# EAGLE design jkw_hdmi_micro_drill (EAGLE 6.5.0)
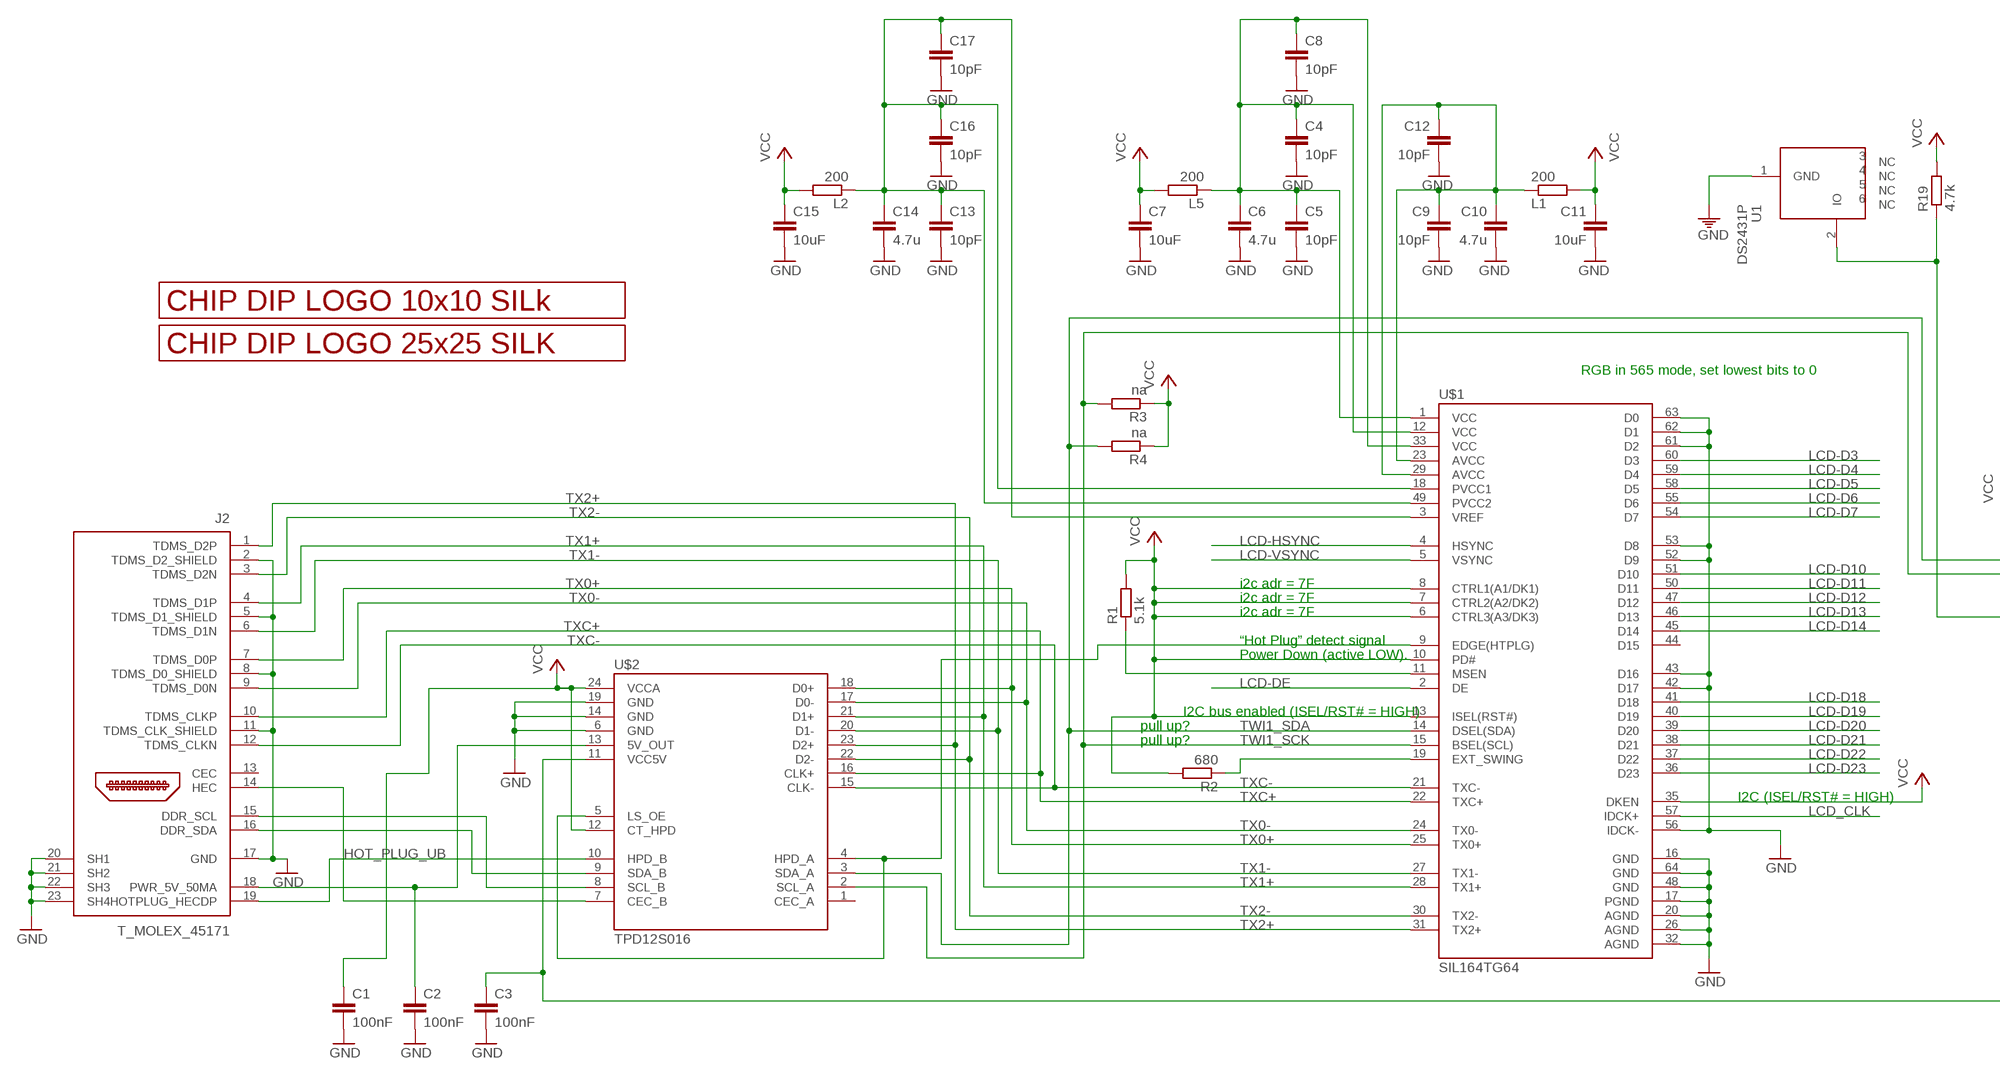
[diagram p0: schematic, sheet 1, part 1 of 2]
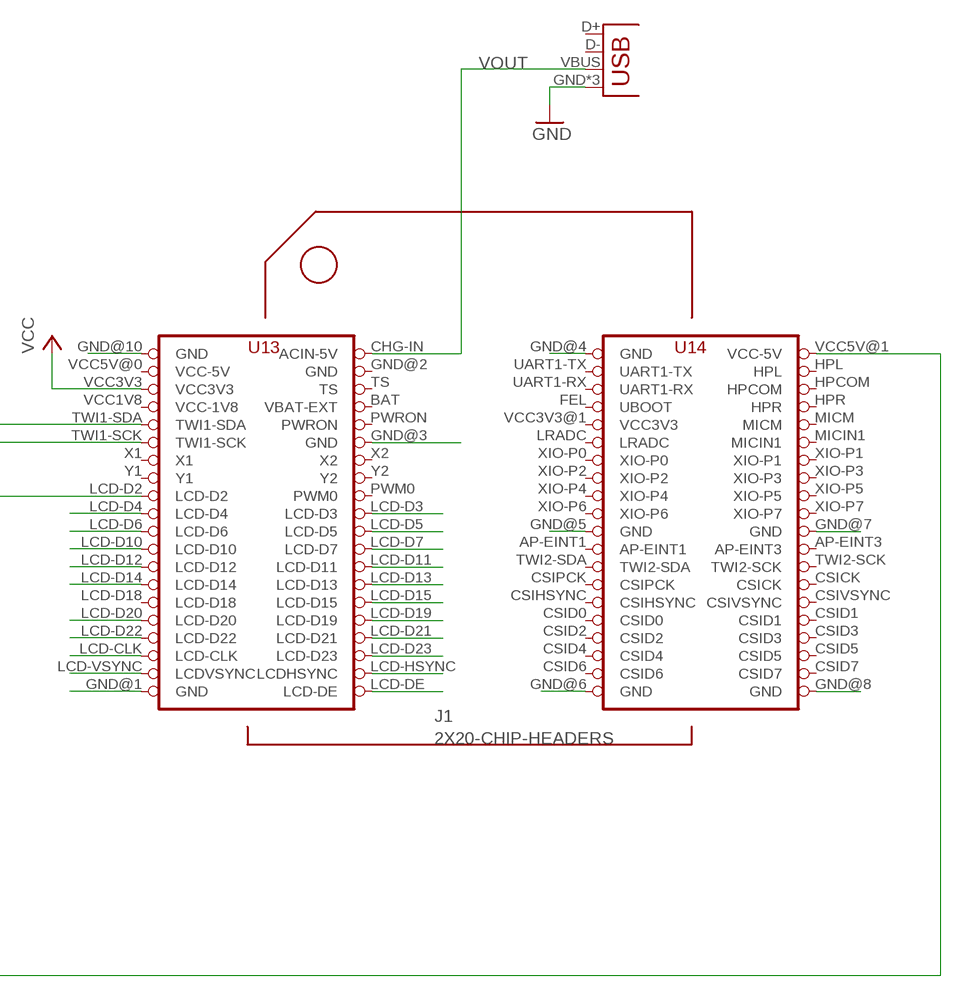
[diagram p1: schematic, sheet 1, part 2 of 2]

## Parts
C1  100nF  C-EUC0805  [C0805]
C2  100nF  C-EUC0805  [C0805]
C3  100nF  C-EUC0805  [C0805]
C4  10pF  C-EUC0805  [C0805]
C5  10pF  C-EUC0805  [C0805]
C6  4.7u  C-EUC0805  [C0805]
C7  10uF  C-EUC0805  [C0805]
C8  10pF  C-EUC0805  [C0805]
C9  10pF  C-EUC0805  [C0805]
C10  4.7u  C-EUC0805  [C0805]
C11  10uF  C-EUC0805  [C0805]
C12  10pF  C-EUC0805  [C0805]
C13  10pF  C-EUC0805  [C0805]
C14  4.7u  C-EUC0805  [C0805]
C15  10uF  C-EUC0805  [C0805]
C16  10pF  C-EUC0805  [C0805]
C17  10pF  C-EUC0805  [C0805]
J1  2X20-CHIP-HEADERS  [2X20CHIP_SM]
J2  T_MOLEX_45171  [T_MOLEX_45171]
L1  200  R-EU_R0805  [R0805]
L2  200  R-EU_R0805  [R0805]
L5  200  R-EU_R0805  [R0805]
POWER_USB  USBUSB-MICROB-SMT-DIP  [USB-MICROB-SMT-DIP]
R1  5.1k  R-EU_M0805  [M0805]
R2  680  R-EU_M0805  [M0805]
R3  na  R-EU_M0805  [M0805]
R4  na  R-EU_M0805  [M0805]
R19  4.7k  R-EU_R0805  [R0805]
U1  DS2431P  [TSOC6]
U$1  SIL164TG64  [TQFP64]
U$2  TPD12S016  [DIL24]
U$3  LOGO_10X10_SILK  [LOGO_10X10_SILK]
U$4  LOGO_25X25_SILK  [LOGO_25X25_SILK]

## Nets
ASD: R1.1 U$1.11(MSEN)
GND: C1.2 C2.2 C3.2 C4.2 C5.2 C6.2 C7.2 C8.2 C9.2 C10.2 C11.2 C12.2 C13.2 C14.2 C15.2 C16.2 C17.2 J1.GND@1(GND) J1.GND@3(GND) J1.GND@4(GND) J1.GND@5(GND) J1.GND@6(GND) J1.GND@7(GND) J1.GND@8(GND) J1.GND@10(GND) J2.2(TDMS_D2_SHIELD) J2.5(TDMS_D1_SHIELD) J2.8(TDMS_D0_SHIELD) J2.11(TDMS_CLK_SHIELD) J2.17(GND) J2.20(SH1) J2.21(SH2) J2.22(SH3) J2.23(SH4) POWER_USB.GND POWER_USB.MT1(GND) POWER_USB.MT2(GND) U1.1(GND) U$1.16(GND) U$1.17(PGND) U$1.20(AGND) U$1.26(AGND) U$1.32(AGND) U$1.42(D17) U$1.43(D16) U$1.48(GND) U$1.52(D9) U$1.53(D8) U$1.56(IDCK-) U$1.61(D2) U$1.62(D1) U$1.63(D0) U$1.64(GND) U$2.6(GND) U$2.14(GND) U$2.19(GND)
HOT_PLUG_UB: J2.19(HOTPLUG_HECDP) U$2.10(HPD_B)
HOTPLUG_DET: U$1.9(EDGE(HTPLG)) U$2.4(HPD_A) U$2.5(LS_OE)
LCD-D3: J1.LCD-D3 U$1.60(D3)
LCD-D4: J1.LCD-D4 U$1.59(D4)
LCD-D5: J1.LCD-D5 U$1.58(D5)
LCD-D6: J1.LCD-D6 U$1.55(D6)
LCD-D7: J1.LCD-D7 U$1.54(D7)
LCD-D10: J1.LCD-D10 U$1.51(D10)
LCD-D11: J1.LCD-D11 U$1.50(D11)
LCD-D12: J1.LCD-D12 U$1.47(D12)
LCD-D13: J1.LCD-D13 U$1.46(D13)
LCD-D14: J1.LCD-D14 U$1.45(D14)
LCD-D15: J1.LCD-D15
LCD-D18: U$1.41(D18)
LCD-D19: J1.LCD-D19 U$1.40(D19)
LCD-D20: J1.LCD-D20 U$1.39(D20)
LCD-D21: J1.LCD-D21 U$1.38(D21)
LCD-D22: J1.LCD-D22 U$1.37(D22)
LCD-D23: J1.LCD-D23 U$1.36(D23)
LCD-DE: J1.LCD-DE U$1.2(DE)
LCD-HSYNC: J1.LCD-HSYNC(LCDHSYNC) U$1.4(HSYNC)
LCD-VSYNC: J1.LCD-VSYNC(LCDVSYNC) U$1.5(VSYNC)
LCD_CLK: J1.LCD-CLK U$1.57(IDCK+)
N$2: R2.1 U$1.19(EXT_SWING)
N$3: C2.1 J2.18(PWR_5V_50MA) U$2.13(5V_OUT)
N$4: C4.1 C5.1 C6.1 C8.1 L5.1 U$1.1(VCC) U$1.12(VCC) U$1.33(VCC)
N$5: J1.LCD-D2 R19.1 U1.2(IO)
N$6: J2.15(DDR_SCL) U$2.8(SCL_B)
N$7: J2.16(DDR_SDA) U$2.9(SDA_B)
N$8: C9.1 C10.1 C12.1 L1.1 U$1.23(AVCC) U$1.29(AVCC)
N$9: J2.14(HEC) U$2.7(CEC_B)
N$10: C13.1 C14.1 C16.1 C17.1 L2.1 U$1.3(VREF) U$1.18(PVCC1) U$1.49(PVCC2)
TWI1_SCK: J1.TWI1-SCK R3.2 U$1.15(BSEL(SCL)) U$2.2(SCL_A)
TWI1_SDA: J1.TWI1-SDA R4.2 U$1.14(DSEL(SDA)) U$2.3(SDA_A)
TX0+: J2.7(TDMS_D0P) U$1.25(TX0+) U$2.18(D0+)
TX0-: J2.9(TDMS_D0N) U$1.24(TX0-) U$2.17(D0-)
TX1+: J2.4(TDMS_D1P) U$1.28(TX1+) U$2.21(D1+)
TX1-: J2.6(TDMS_D1N) U$1.27(TX1-) U$2.20(D1-)
TX2+: J2.1(TDMS_D2P) U$1.31(TX2+) U$2.23(D2+)
TX2-: J2.3(TDMS_D2N) U$1.30(TX2-) U$2.22(D2-)
TXC+: J2.10(TDMS_CLKP) U$1.22(TXC+) U$2.16(CLK+)
TXC-: J2.12(TDMS_CLKN) U$1.21(TXC-) U$2.15(CLK-)
VCC: C1.1 C7.1 C11.1 C15.1 J1.VCC3V3 L1.2 L2.2 L5.2 R1.2 R2.2 R3.1 R4.1 R19.2 U$1.6(CTRL3(A3/DK3)) U$1.7(CTRL2(A2/DK2)) U$1.8(CTRL1(A1/DK1)) U$1.10(PD#) U$1.13(ISEL(RST#)) U$1.35(DKEN) U$2.12(CT_HPD) U$2.24(VCCA)
VCC_5V_DCC: C3.1 J1.VCC5V@1(VCC-5V) U$2.11(VCC5V)
VOUT: J1.CHG-IN(ACIN-5V) POWER_USB.VBUS
Unconnected: J1.AP-EINT1 J1.AP-EINT3 J1.BAT(VBAT-EXT) J1.CSICK J1.CSID0 J1.CSID1 J1.CSID2 J1.CSID3 J1.CSID4 J1.CSID5 J1.CSID6 J1.CSID7 J1.CSIHSYNC J1.CSIPCK J1.CSIVSYNC J1.FEL(UBOOT) J1.HPCOM J1.HPL J1.HPR J1.LCD-D18 J1.LRADC J1.MICIN1 J1.MICM J1.PWM0 J1.PWRON J1.TS J1.TWI2-SCK J1.TWI2-SDA J1.UART1-RX J1.UART1-TX J1.X1 J1.X2 J1.XIO-P0 J1.XIO-P1 J1.XIO-P2 J1.XIO-P3 J1.XIO-P4 J1.XIO-P5 J1.XIO-P6 J1.XIO-P7 J1.Y1 J1.Y2 J2.13(CEC) POWER_USB.D+ POWER_USB.D- U1.3(NC) U1.4(NC) U1.5(NC) U1.6(NC) U$2.1(CEC_A)

## Notes on the sheet
- RGB in 565 mode, set lowest bits to 0
- i2c adr = 7F
- i2c adr = 7F
- i2c adr = 7F
- “Hot Plug” detect signal
- Power Down (active LOW).
- I2C bus enabled (ISEL/RST# = HIGH)
- pull up?
- pull up?
- I2C (ISEL/RST# = HIGH)

## Power pins joined to a net without a drawn wire
D15: U$1.44(D15)
GND: J1.GND@2(GND)
VCC3V3: J1.VCC3V3@1(VCC3V3)
VCC-1V8: J1.VCC1V8(VCC-1V8)
VCC-5V: J1.VCC5V@0(VCC-5V)

## Library data of the parts
C1-C17 = rcl:C-EU: CAPACITOR, European symbol
J1 = VGA-DIP:2X20-CHIP-HEADERS: Through hole layout with chip reference
J2 = CHIP_HDMI:T_MOLEX_45171
L1 L2 L5 R1-R4 R19 = rcl:R-EU_: RESISTOR, European symbol
POWER_USB = Spark:USB
U1 = VGA-DIP:DS2431: 1024-Bit EEPROM This chip provides a 4x256 Bit EEPROM, which can be programmed@5V. Write protection and OTP emulation are available, too. Author: Jan Kandziora <jjj@gmx.de>; DESCRIPTION: IC, 1024-Bit, 1-Wire EEPROM, TSOC6; FOOTPRINT: TSOC6; LINK: http://www.digikey.com/product-detail/en/DS2431P%2BT%26R/DS2431P%2BT%26RCT-ND/3647900; MFG: DIGIKEY; MFG_PN: DS2431P+T&RCT-ND; PART_TYPE: IC; PRICE: 0.98; VENDOR: MAXIM; VENDOR_PART_NUMBER: DS2431P+T&R
U$1 = SII164CTG64:SIL164TG64
U$2 = SII164CTG64:TPD12S016
U$3 = logo:LOGO_10X10_SILK
U$4 = logo:LOGO_25X25_SILK

## Board
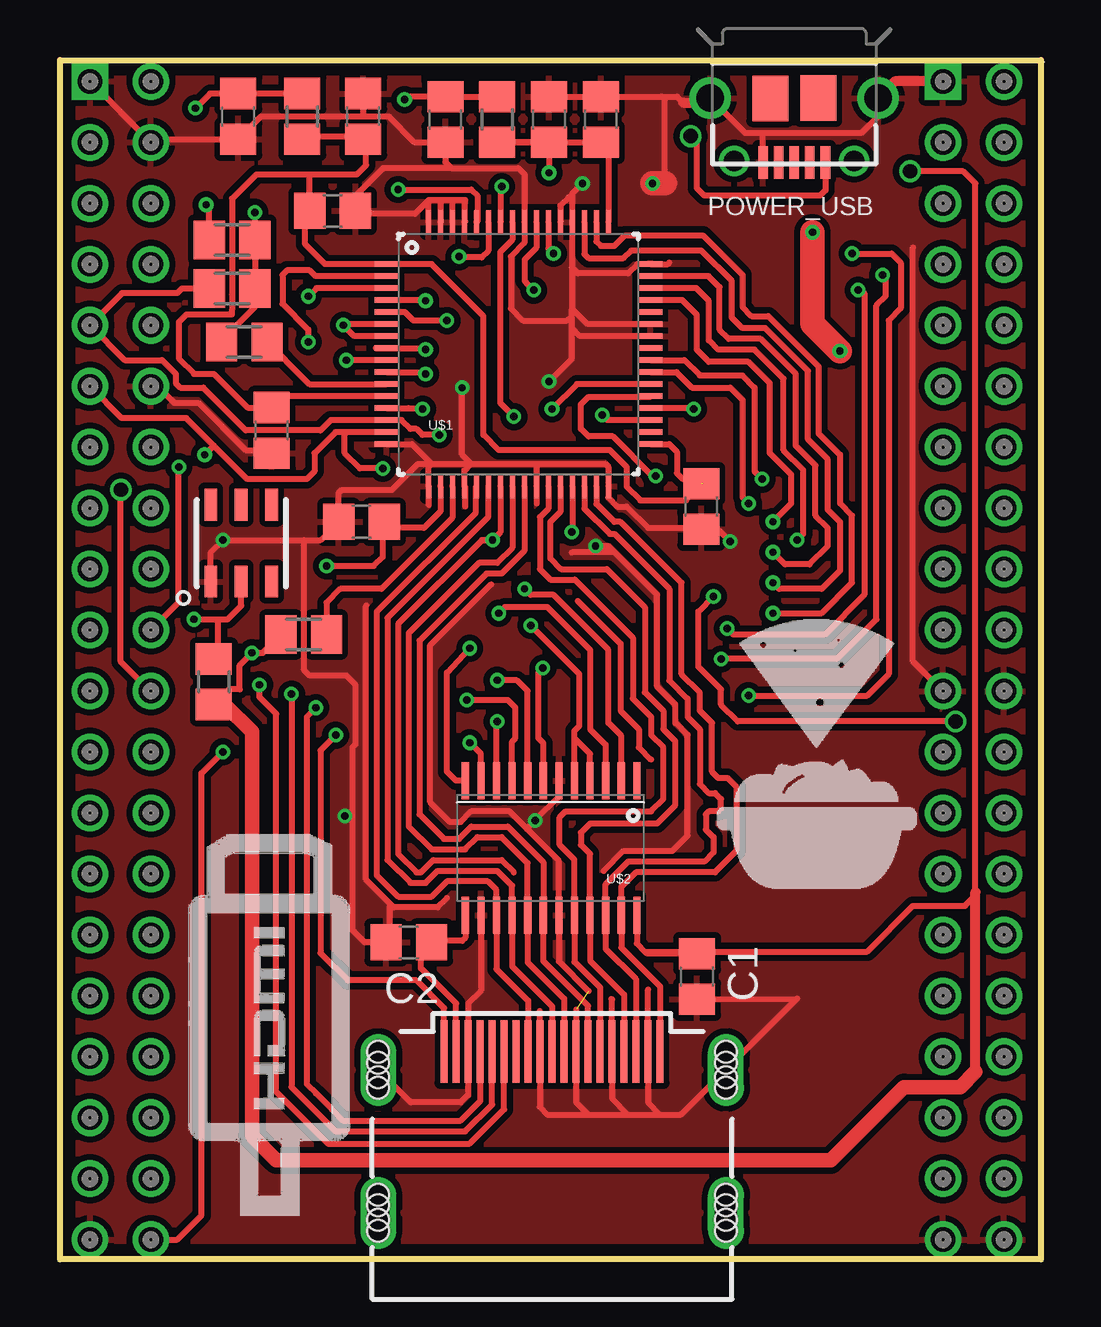
[diagram p2: board, top side]
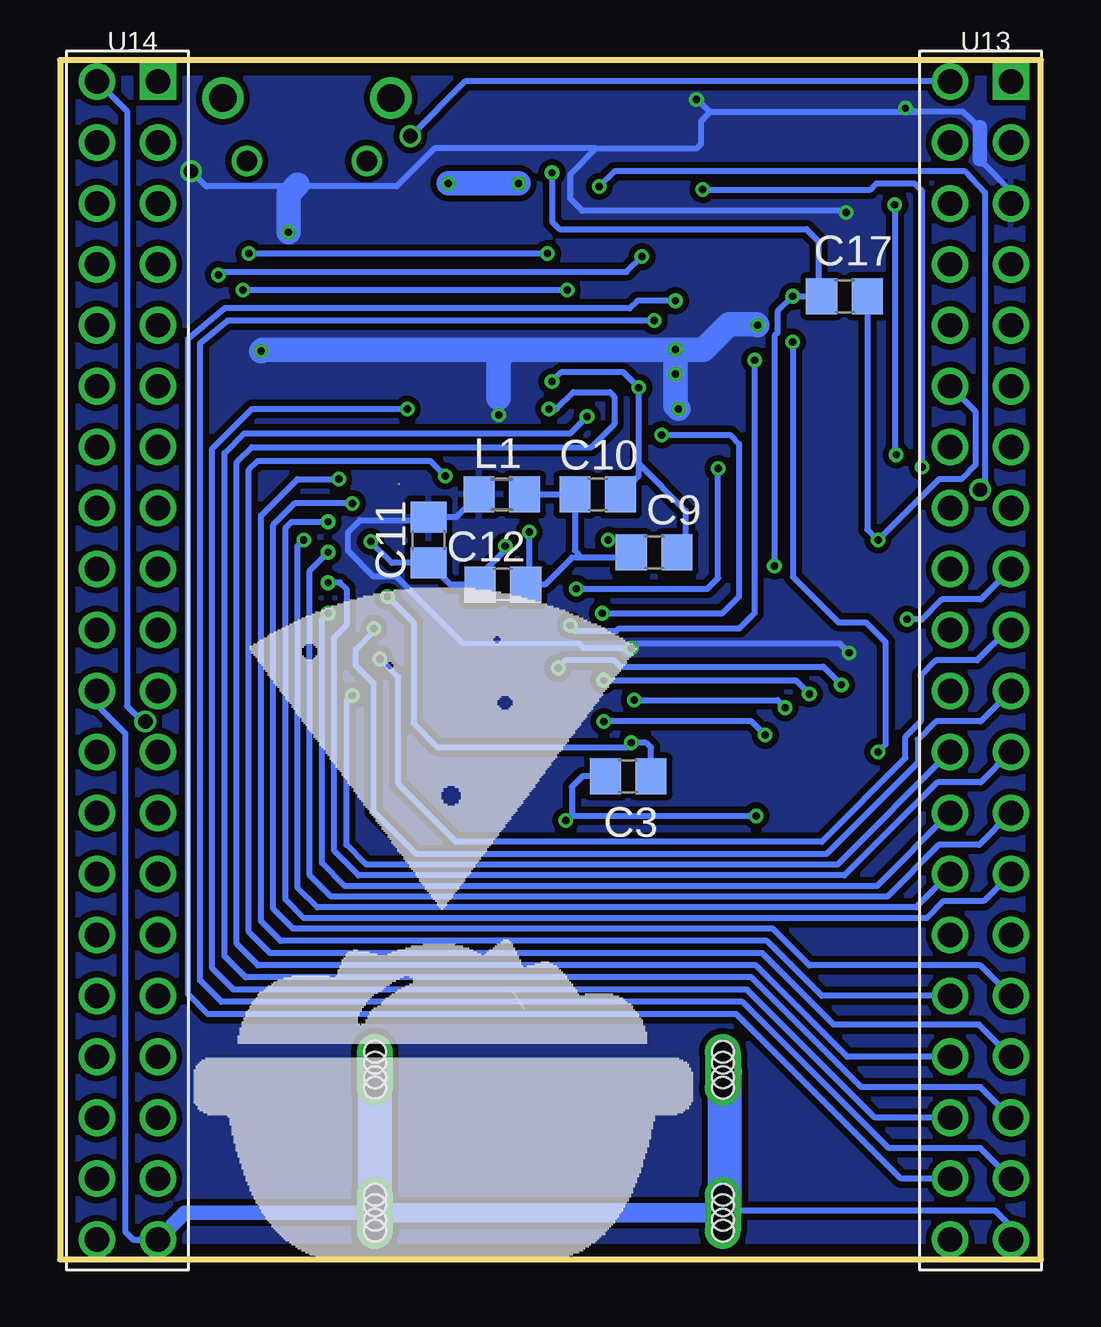
[diagram p3: board, bottom side, seen from below]

Size 40.89 x 49.97 mm. Coordinates in mm from the lower left corner, seen from the top.
Outline: 0,49.97 40.89,49.97 40.89,0 0,0 0,49.97
Copper layers (1*16): Top 0.035mm / dielectric 1.6mm / Bottom 0.035mm
Design rules "Elecrow_2-layer_PCB_eagle_rule": minimum track width 6mil, minimum drill 12mil, track to track 6mil, track to pad 6mil, pad to pad 6mil, via to via 8mil, smd to smd 0mil, copper to edge 20mil, drill to drill 10mil, minimum pad ring 6mil, minimum via ring 6mil, stop-mask expansion 0mil, vias tented up to drill 100mil, thermal gap 10mil

### Footprints (pad centres in the part's own frame; a part is rotated, then mirrored left to right if it is on the bottom)
C0805 = smd 1.3 x 1.5: 1 -0.95,0; 2 0.95,0
2X20CHIP_SM = drill 1.016: AP-EINT1 36.81,21.65; AP-EINT3 39.35,21.65; BAT 3.79,41.97; CHG-IN 3.79,49.59; CSICK 39.35,16.57; CSID0 36.81,11.49; CSID1 39.35,11.49; CSID2 36.81,8.95; CSID3 39.35,8.95; CSID4 36.81,6.41; CSID5 39.35,6.41; CSID6 36.81,3.87; CSID7 39.35,3.87; CSIHSYNC 36.81,14.03; CSIPCK 36.81,16.57; CSIVSYNC 39.35,14.03; FEL 36.81,41.97; GND@1 3.79,36.89; GND@2 1.25,1.33; GND@4 39.35,24.19; GND@5 39.35,1.33; GND@6 36.81,1.33; GND@7 36.81,24.19; GND@10 3.79,47.05; HPCOM 39.35,44.51; HPL 39.35,47.05; HPR 39.35,41.97; LCD-CLK 1.25,6.41; LCD-D2 1.25,29.27; LCD-D3 3.79,26.73; LCD-D4 1.25,26.73; LCD-D5 3.79,24.19; LCD-D6 1.25,24.19; LCD-D7 3.79,21.65; LCD-D10 1.25,21.65; LCD-D11 3.79,19.11; LCD-D12 1.25,19.11; LCD-D13 3.79,16.57; LCD-D14 1.25,16.57; LCD-D15 3.79,14.03; LCD-D18 1.25,14.03; LCD-D19 3.79,11.49; LCD-D20 1.25,11.49; LCD-D21 3.79,8.95; LCD-D22 1.25,8.95; LCD-D23 3.79,6.41; LCD-DE 3.79,1.33; LCD-HSYNC 3.79,3.87; LCD-VSYNC 1.25,3.87; LRADC 36.81,36.89; MICIN1 39.35,36.89; MICM 39.35,39.43; PWM0 3.79,29.27; PWRON 3.79,39.43; TS 3.79,44.51; TWI1-SCK 1.25,36.89; TWI1-SDA 1.25,39.43; TWI2-SCK 39.35,19.11; TWI2-SDA 36.81,19.11; UART1-RX 36.81,44.51; UART1-TX 36.81,47.05; VCC1V8 1.25,41.97; VCC3V3 1.25,44.51; VCC3V3@1 36.81,39.43; VCC5V@0 1.25,47.05; VCC5V@1 39.35,49.59; X1 1.25,34.35; X2 3.79,34.35; XIO-P0 36.81,34.35; XIO-P1 39.35,34.35; XIO-P2 36.81,31.81; XIO-P3 39.35,31.81; XIO-P4 36.81,29.27; XIO-P5 39.35,29.27; XIO-P6 36.81,26.73; XIO-P7 39.35,26.73; Y1 1.25,31.81; Y2 3.79,31.81 | drill 1.016 square: GND@3 1.25,49.59; GND@8 36.81,49.59
T_MOLEX_45171 = smd 0.3 x 2.6: 1 4.5,10.31; 2 4,10.31; 3 3.5,10.31; 4 3,10.31; 5 2.5,10.31; 6 2,10.31; 7 1.5,10.31; 8 1,10.31; 9 0.5,10.31; 10 0,10.31; 11 -0.5,10.31; 12 -1,10.31; 13 -1.5,10.31; 14 -2,10.31; 15 -2.5,10.31; 16 -3,10.31; 17 -3.5,10.31; 18 -4,10.31; 19 -4.5,10.31 | drill 0.9 pad 1.499 long: 20 -7.25,3.59; 21 7.25,3.59; 22 7.25,9.55; 23 -7.25,9.55 | hole 0.9: -7.25,10.3; -7.25,8.8; -7.25,9.85; -7.25,9.25; -7.25,4.35; -7.25,2.85; -7.25,3.9; -7.25,3.3; 7.25,10.3; 7.25,8.8; 7.25,9.85; 7.25,9.25; 7.25,4.35; 7.25,3.9; 7.25,2.85; 7.25,3.3
R0805 = smd 1.3 x 1.5: 1 -0.95,0; 2 0.95,0
USB-MICROB-SMT-DIP = smd 0.4 x 1.35: D+ 0,2.675; D- -0.65,2.675; GND 1.3,2.675; ID 0.65,2.675; VBUS -1.3,2.675 | drill 1.15 pad 1.7: MT1 -3.5,0; MT2 3.5,0 | drill 0.85 pad 1.25: MT3 -2.5,2.625; MT4 2.5,2.625 | smd 1.5 x 1.9: P$1 -1,0; P$2 1,0.01
M0805 = smd 1.3 x 1.6: 1 -0.95,0; 2 0.95,0
TSOC6 = smd 0.53 x 1.33: 1 -1.27,-1.6; 2 0,-1.6; 3 1.27,-1.6; 4 1.27,1.6; 5 0,1.6; 6 -1.27,1.6
TQFP64 = smd 1 x 0.22: 1 -5.5,3.75; 2 -5.5,3.25; 3 -5.5,2.75; 4 -5.5,2.25; 5 -5.5,1.75; 6 -5.5,1.25; 7 -5.5,0.75; 8 -5.5,0.25; 9 -5.5,-0.25; 10 -5.5,-0.75; 11 -5.5,-1.25; 12 -5.5,-1.75; 13 -5.5,-2.25; 14 -5.5,-2.75; 15 -5.5,-3.25; 16 -5.5,-3.75; 33 5.5,-3.75; 34 5.5,-3.25; 35 5.5,-2.75; 36 5.5,-2.25; 37 5.5,-1.75; 38 5.5,-1.25; 39 5.5,-0.75; 40 5.5,-0.25; 41 5.5,0.25; 42 5.5,0.75; 43 5.5,1.25; 44 5.5,1.75; 45 5.5,2.25; 46 5.5,2.75; 47 5.5,3.25; 48 5.5,3.75 | smd 0.22 x 1: 17 -3.75,-5.5; 18 -3.25,-5.5; 19 -2.75,-5.5; 20 -2.25,-5.5; 21 -1.75,-5.5; 22 -1.25,-5.5; 23 -0.75,-5.5; 24 -0.25,-5.5; 25 0.25,-5.5; 26 0.75,-5.5; 27 1.25,-5.5; 28 1.75,-5.5; 29 2.25,-5.5; 30 2.75,-5.5; 31 3.25,-5.5; 32 3.75,-5.5; 49 3.75,5.5; 50 3.25,5.5; 51 2.75,5.5; 52 2.25,5.5; 53 1.75,5.5; 54 1.25,5.5; 55 0.75,5.5; 56 0.25,5.5; 57 -0.25,5.5; 58 -0.75,5.5; 59 -1.25,5.5; 60 -1.75,5.5; 61 -2.25,5.5; 62 -2.75,5.5; 63 -3.25,5.5; 64 -3.75,5.5
DIL24 = smd 0.3 x 1.55: 1 -3.6,-2.8; 2 -2.95,-2.8; 3 -2.3,-2.8; 4 -1.65,-2.8; 5 -1,-2.8; 6 -0.35,-2.8; 7 0.3,-2.8; 8 0.95,-2.8; 9 1.6,-2.8; 10 2.25,-2.8; 11 2.9,-2.8; 12 3.55,-2.8; 13 3.55,2.8; 14 2.9,2.8; 15 2.25,2.8; 16 1.6,2.8; 17 0.95,2.8; 18 0.3,2.8; 19 -0.35,2.8; 20 -1,2.8; 21 -1.65,2.8; 22 -2.3,2.8; 23 -2.95,2.8; 24 -3.6,2.8

### Placement (x,y rotation side)
C1  26.56,11.79 270 top
C2  14.54,13.21 180 top
C3  17.21,20.13 180 bottom
C4  8.83,34.54 270 top
C5  11.37,43.69 0 top
C6  12.64,47.62 90 top
C7  7.43,47.62 270 top
C8  26.73,31.37 270 top
C9  16.13,29.46 0 bottom
C10  18.48,31.88 0 bottom
C11  25.53,29.97 270 bottom
C12  22.43,28.12 180 bottom
C13  22.54,47.5 90 top
C14  20.38,47.5 90 top
C15  16.07,47.5 270 top
C16  12.57,30.73 180 top
C17  8.19,40.13 0 bottom
J1  0,-0.51 0 top
J2  20.51,-1.65 0 top
L1  22.48,31.88 180 bottom
L2  18.22,47.5 90 top
L5  10.1,47.62 90 top
POWER_USB  30.61,48.39 180 top
R1  7.68,38.23 180 top
R2  10.16,26.04 180 top
R3  7.18,42.48 180 top
R4  7.18,40.45 180 top
R19  6.41,24.07 270 top
U1  7.56,29.84 0 top
U$1  19.11,37.72 0 top
U$2  20.45,17.15 180 top
U$3  27.37,15.43 0 top
U$4  35.37,-0.13 0 bottom

### Tracks (layer width: path | path; a pad name or v marks a point on that pad's centre or on a via)
ASD
  Top 0.254: R1.1 8.45,38.42 10.39,36.47 U$1.11
GND  (via drill 0.3)  (1 unrouted)
  Top 0.254: C14.2 C13.2 25.08,48.45 | 24.51,11.24 J2.2 24.51,6.54 25.02,6.03 | J2.11 | J2.11 20,10.35 | 21.53,10.41 21.53,8.68 J2.8 21.51,6.56 22.04,6.03 | 22.99,10.86 23.01,10.84 J2.5 23.01,6.71 23.69,6.03 | 22.04,11.18 20.8,12.41 U$2.19 20.8,16.6 19.46,17.94 | 19.88,31.5 19.88,32.21 | 19.88,32.21 U$1.26 | 17.97,28.13 15.43,25.59 15.43,19.05 16.26,18.23 16.7,18.23 17.14,18.67 18.73,18.67 19.46,17.94 | 20.83,19.91 U$2.6 20.8,19.27 v19.81,18.29 19.46,17.94 | J2.23 14.62,6.54 16.7,6.54 17.01,6.85 J2.17 17.02,10.67 17.55,11.2 U$2.14 | 25.4,41.53 25.34,41.47 U$1.48 24.07,41.47 23.69,41.09 21.59,41.09 21.34,41.34 21.36,41.37 | U$1.52 21.36,44.11 21.21,44.26 20.86,43.91 U$1.53 | U$1.61 16.89,43.25 16.89,44.13 16.32,44.13 | U$1.63 15.88,43.23 15.88,44.13 | 16.32,44.13 15.88,44.13 | 15.88,44.13 15.37,44.13 15.36,44.13 | 16.89,31.37 16.89,32.19 U$1.20 16.86,32.87 17.14,33.15 | 15.37,31.43 U$1.17 15.36,33.02 15.49,33.15 | J1.GND@1 4.07,36.38 4.76,35.69 5.78,35.69 7.75,33.72 8.7,33.72 C4.2 | 27.94,8.08 J2.22 | 19.88,32.21 19.88,33.08 19.94,33.15 | 19.94,33.15 22.73,33.15 22.86,33.02 U$1.32 22.86,31.75 23.24,31.37 23.62,31.37 24.51,30.48 26.67,30.48 C8.2 26.8,30.35 27.49,30.35 v27.94,29.91 | 17.14,33.15 19.94,33.15 | U$1.16 14.67,33.97 15.49,33.15 | U$1.64 15.36,44.13 | U$1.52 21.36,44.41 v21.78,44.83 | 21.36,41.37 U$1.52 | U$1.43 21.99,38.97 21.36,39.6 | 21.36,39.6 21.36,41.37 | U$1.42 21.67,38.47 21.34,38.8 | 21.34,38.8 21.34,39.31 | 21.34,39.31 21.34,39.57 21.36,39.6 | 17.14,33.15 16.76,33.53 v16.76,36.32 | v20.38,36.58 21.34,37.53 21.34,38.8 | 15.49,33.15 17.14,33.15 | 25.08,48.45 25.72,48.45 25.97,48.2 | 15.36,44.13 14.8,43.56 12.44,43.56 C5.2 12.32,44.32 13.46,45.47 16.32,45.47
  Top 0.254: 16.32,45.47 16.07,45.72 C15.2 14.77,46.55 13.69,47.62 12.7,47.62 | 16.32,45.47 19.11,45.47 19.37,45.21 U$1.56 19.36,42.35 18.8,41.78 18.8,39.62 19.3,39.12 21.15,39.12 21.34,39.31 | 12.7,47.62 8.38,47.62 C7.2 3.92,46.68 J1.GND@10 J1.GND@3 | C6.2 12.64,47.69 12.7,47.62 | U$1.62 16.36,44.09 16.32,44.13 | U1.1 6.29,29.46 v6.79,29.97 10.16,29.97 | 10.16,29.97 10.86,29.97 C16.2 11.62,31.94 11.75,32.07 13.84,32.07 14.92,33.15 15.49,33.15 | J2.11 20,6.35 20.32,6.03 22.04,6.03 | 22.04,6.03 23.69,6.03 | 23.69,6.03 25.02,6.03 | 25.02,6.03 25.89,6.03 J2.22 | 10.16,29.97 10.16,24.57 10.41,24.32 11.94,24.32 12.32,23.94 12.32,21.46 12.19,21.34 12.19,13.72 12.7,13.21 C2.2 13.75,13.37 13.75,14.82 | C1.2 30.72,10.86 J2.22 | J1.GND@7 35.56,24.93 35.56,42.16 | POWER_USB.MT1 34.11,47.63 33.4,46.93 29.34,46.93 | 29.34,46.93 28.57,46.93 POWER_USB.MT2 | POWER_USB.GND 29.31,46.9 29.34,46.93 | 25.21,44.83 25.21,48.32 25.08,48.45 | 16.13,15.05 15.75,14.67 13.91,14.67 13.75,14.82 | 13.75,14.82 12.76,15.81 12.76,27.24 | 22.67,16.19 23.49,17.02 25.53,17.02 26.16,17.65 26.16,21.84 25.65,22.35 25.65,23.11 24.89,23.88 24.89,27.69 23.11,29.46 | 23.11,29.46 21.34,29.46 | 23.11,29.46 22.86,29.72 v22.33,29.72
  Top 0.406: 25.97,48.2 27.11,48.2 POWER_USB.MT2 | J1.GND@8 34.8,49.08 POWER_USB.MT1
  Top 1.016: v24.7,44.83 25.21,44.83
  Bottom 0.254: J1.GND@2 1.25,1.38 1.91,2.03 13.17,2.03 J2.20 | J1.GND@6 37.85,0.82 38.16,1.14 38.16,21.91 39.35,23.09 J1.GND@4 | 13.17,7.81 J2.23 | C3.2 19.11,20.13 19.56,19.69 19.56,18.54 19.62,18.48 | v20.38,36.58 20,36.96 17.4,36.96 v16.76,36.32 16.76,33.15 | C10.2 16.76,32.64 16.76,33.15 | C9.2 14.8,29.85 14.8,31.18 16.76,33.15 | C17.2 7.24,30.42 v6.79,29.97 4.25,32.51 3.3,32.51 2.74,33.08 2.74,35.34 J1.GND@1 | 25.21,28.7 C11.2 | C11.2 27.05,29.02 v27.94,29.91 | 19.62,18.48 v19.81,18.29 | 19.62,18.48 v11.88,18.48 | 23.38,28.6 23.38,28.51 | C11.2 24.62,28.12 C12.2 23.38,28.51 | 23.38,28.51 22.33,29.56 v22.33,29.72
  Bottom 0.61: J2.21 35.69,1.94 J1.GND@6
  Bottom 0.813: J2.20 J2.21
  Bottom 1.016: v21.78,44.83 v24.7,44.83
  Bottom 1.422: J2.21 J2.22 | 13.17,2.03 13.17,7.81
  pour Top (isolate 0.254): 0.13,0 40.89,0 40.89,50 0.13,50
HOT_PLUG_UB  (via drill 0.3)
  Top 0.254: J2.19 16.01,10.47 14.86,11.62 12,11.62 10.86,12.76 10.86,21.21 v11.49,21.84 | U$2.10 18.2,22.39 v18.22,22.41
  Bottom 0.254: v11.49,21.84 12.07,22.41 v18.22,22.41
HOTPLUG_DET  (via drill 0.3)
  Top 0.254: U$2.5 21.45,21.72 | U$2.4 22.1,21.07 21.45,21.72 | U$1.9 v11.94,37.47 | v19.62,26.42 21.65,24.38 21.65,22.23 21.45,22.02 21.45,21.72
  Bottom 0.254: v11.94,37.47 11.94,26.92 12.57,26.29 17.59,26.29 17.72,26.16 19.37,26.16 v19.62,26.42
LCD-D3  (via drill 0.3)
  Top 0.254: J1.LCD-D3 4.95,27.38 v4.95,33.02 | v14.1,44.58 17.14,44.58 17.4,44.32 17.4,43.25 U$1.60
  Bottom 0.254: v4.95,33.02 4.95,44.51 5.27,44.83 6.86,44.83 7.11,44.58 v14.1,44.58
LCD-D4  (via drill 0.3)
  Top 0.254: v34.29,41.02 34.42,40.89 34.42,40.13 34.04,39.75 34.04,26.67 32.38,25.02 v27.56,25.02 | U$1.59 17.86,42.03 17.58,41.75 16.67,41.75 v16.64,41.78
  Bottom 0.254: J1.LCD-D4 1.4,26.22 2.67,24.95 4.38,24.95 5.02,24.32 5.02,22.41 5.65,21.78 5.65,20.89 9.14,17.4 24.38,17.4 26.8,19.81 26.8,24.26 v27.56,25.02 | v34.29,41.02 34.16,41.15 17.27,41.15 v16.64,41.78
LCD-D5  (via drill 0.3, 0.6)
  Top 0.254: v2.54,32.07 2.54,24.89 3.75,23.68 J1.LCD-D5 | v18.41,44.7 18.36,44.65 U$1.58
  Bottom 0.254: v18.41,44.7 17.78,45.34 3.18,45.34 2.34,44.45 2.34,32.27 v2.54,32.07
LCD-D6  (via drill 0.3)
  Top 0.254: v33.27,40.39 33.4,40.39 33.53,40.26 33.53,27.69 31.88,26.04 28.07,26.04 v27.81,26.29 | U$1.55 19.86,42.15 19.37,41.66 19.37,40.77 v19.75,40.39 19.43,40.7
  Bottom 0.254: J1.LCD-D6 2.52,22.41 4.38,22.41 5.14,21.65 5.14,20.7 8.95,16.89 26.04,16.89 27.81,18.67 27.81,24 28.58,24.77 28.58,25.4 27.81,26.16 v27.81,26.29 | v19.75,40.39 v33.27,40.39
LCD-D7  (via drill 0.3)
  Top 0.254: v28.7,23.49 33.66,23.49 34.54,24.38 34.54,39.12 35.05,39.62 35.05,41.53 34.67,41.91 v33.02,41.91 | U$1.54 20.36,42.12 v20.57,41.91
  Bottom 0.254: J1.LCD-D7 8.49,16.45 28.13,16.45 28.96,17.27 28.96,23.24 v28.7,23.49 | v20.57,41.91 v33.02,41.91
LCD-D10  (via drill 0.3)
  Top 0.254: U$1.51 21.86,41.89 22.04,41.72 23.49,41.72 23.81,42.04 26.73,42.04 28,40.77 28,39.24 28.45,38.8 29.4,38.8 31.18,37.02 31.18,34.16 32,33.34 32,31.24 32.51,30.73 32.51,28.7 31.75,27.94 29.97,27.94 v29.72,28.19
  Bottom 0.254: J1.LCD-D10 2.52,19.88 4.32,19.88 8.19,16 28.45,16 29.46,17.02 29.46,25.91 28.96,26.42 28.96,27.94 29.21,28.19 v29.72,28.19
LCD-D11  (via drill 0.3)
  Top 0.254: U$1.50 22.36,42.41 22.54,42.23 23.11,42.23 23.56,42.67 26.8,42.67 28.45,41.02 28.45,39.69 28.83,39.31 29.53,39.31 31.62,37.21 31.62,34.42 32.51,33.53 32.51,31.5 33.02,30.99 33.02,28.19 31.75,26.92 v29.72,26.92
  Bottom 0.254: J1.LCD-D11 6.84,15.56 29.02,15.56 29.97,16.51 29.97,26.67 v29.72,26.92
LCD-D12  (via drill 0.3)
  Top 0.254: v29.72,29.46 30.23,28.96 31.24,28.96 32,29.72 32,30.48 31.5,30.99 31.5,33.08 30.67,33.91 30.67,36.89 29.21,38.35 27.88,38.35 27.49,38.73 27.49,40.51 27.04,40.97 U$1.47
  Bottom 0.254: J1.LCD-D12 2.58,17.27 4.25,17.27 6.41,15.11 29.59,15.11 30.48,16 30.48,28.7 v29.72,29.46
LCD-D13  (via drill 0.3)
  Top 0.254: v30.73,29.97 30.99,30.23 30.99,32.89 30.16,33.72 30.16,36.7 28.96,37.91 27.43,37.91 27.05,38.29 27.05,39.94 26.52,40.47 U$1.46
  Bottom 0.254: J1.LCD-D13 3.81,16.06 5.21,14.67 30.16,14.67 30.99,15.49 30.99,29.72 v30.73,29.97
LCD-D14  (via drill 0.3)
  Top 0.254: v29.72,30.73 30.48,31.5 30.48,32.7 29.59,33.59 29.59,36.51 28.7,37.4 27.05,37.4 26.54,37.91 26.54,39.37 25.94,39.97 U$1.45
  Bottom 0.254: J1.LCD-D14 2.39,14.92 4.06,14.92 4.76,14.22 30.73,14.22 31.5,14.99 31.5,30.48 31.24,30.73 v29.72,30.73
LCD-D19  (via drill 0.3)
  Top 0.254: U$1.40 26.03,37.47 26.67,36.83 28.45,36.83 28.96,36.32 28.96,32.83 v29.27,32.51
  Bottom 0.254: J1.LCD-D19 9.14,10.98 11.43,13.27 31.69,13.27 32.51,14.1 32.51,30.99 30.99,32.51 v29.27,32.51
LCD-D20  (via drill 0.3)
  Top 0.254: U$1.39 25.71,36.97 26.35,36.32 27.94,36.32 28.45,35.81 28.45,31.75 v28.7,31.5
  Bottom 0.254: J1.LCD-D20 2.52,12.26 9.65,12.26 11.18,13.78 31.18,13.78 32,14.6 32,30.61 31.12,31.5 v28.7,31.5
LCD-D21  (via drill 0.3)
  Top 0.254: U$1.38 21.55,36.47 v20.51,35.43
  Bottom 0.254: J1.LCD-D21 8.06,8.44 11.88,12.26 32.64,12.26 33.53,13.14 33.53,33.21 32.89,33.84 18.73,33.84 17.78,34.8 17.78,35.94 17.97,36.13 19.49,36.13 20.19,35.43 v20.51,35.43
LCD-D22  (via drill 0.3)
  Top 0.254: 24.77,32.7 v24.83,32.64 24.7,32.64 23.05,34.29 22.04,34.29 21.72,34.61 21.72,35.62 22.04,35.94 24.59,35.94 U$1.37
  Bottom 0.254: J1.LCD-D22 2.59,9.78 8.64,9.78 11.62,12.76 32.13,12.76 33.02,13.65 33.02,32.89 32.64,33.27 25.46,33.27 v24.83,32.64
LCD-D23  (via drill 0.3)
  Top 0.254: v26.42,35.43 26.38,35.47 U$1.36
  Bottom 0.254: J1.LCD-D23 6.92,5.9 12.26,11.24 33.66,11.24 34.54,12.13 34.54,33.78 32.89,35.43 v26.42,35.43
LCD-DE  (via drill 0.3)
  Top 0.254: U$1.2 10.66,40.97 10.41,41.21 9.46,41.21 9.27,41.02 9.27,39.82 10.35,38.73 v10.35,38.23 | J1.LCD-DE 4.89,0.82 5.91,1.84 5.91,20.26 v6.79,21.15
  Bottom 0.254: v10.35,38.23 10.35,28.45 8.45,26.54 7.3,26.54 6.48,25.72 6.48,21.46 v6.79,21.15
LCD-HSYNC  (via drill 0.3)
  Top 0.254: v15.24,39.94 15.21,39.97 U$1.4
  Bottom 0.254: J1.LCD-HSYNC 5.84,3.36 12.7,10.22 34.73,10.22 35.56,11.05 35.56,38.35 34.04,39.62 17.14,39.62 16.83,39.94 v15.24,39.94
LCD-VSYNC  (via drill 0.3)
  Top 0.254: v16.13,39.12 14.73,39.12 14.38,39.47 U$1.5
  Bottom 0.254: J1.LCD-VSYNC 2.52,4.64 6.35,4.64 12.45,10.73 34.16,10.73 35.05,11.62 35.05,38.16 33.91,39.12 v16.13,39.12
LCD_CLK  (via drill 0.3)
  Top 0.254: 18.86,35.18 v18.92,35.12 18.35,35.69 18.35,41.97 18.86,42.48 U$1.57
  Bottom 0.254: J1.LCD-CLK 2.52,7.18 7.49,7.18 12.07,11.75 33.15,11.75 34.04,12.64 34.04,33.59 33.21,34.42 19.62,34.42 v18.92,35.12
N$2
  Top 0.254: U$1.19 16.36,30.91 13.4,27.94 11.68,27.94 11.11,27.37 R2.1
N$3
  Top 0.254: U$2.13 16.9,13.4 16.76,13.27 15.5,13.27 C2.1 15.05,13.21 15.05,12.13 16.51,10.67 J2.18
N$4  (1 unrouted)
  Top 0.254: U$1.33 25.4,33.97 25.72,33.66 25.72,32.77 25.97,32.51 26.54,32.51 C8.1 | U$1.12 9.3,35.97 C4.1 7.81,35.49 6.41,36.89 5.59,36.89 4.95,37.53 4.95,39.05 5.27,39.37 7.18,39.37 7.18,39.56 7.18,40.2 7.18,44.2 8.19,45.21 10.41,45.21 | L5.1 10.22,46.8 12.51,46.8 C6.1 12.76,46.68 12.76,45.59 12.38,45.21 10.41,45.21 | 10.41,45.21 10.42,45.21 C5.1 10.22,43.5 10.22,42.29 11.05,41.47 U$1.1 15.49,41.47 17.65,39.31 17.65,34.35 18.29,33.72 22.92,33.72 23.62,33.02 23.62,32.2 24.19,31.62 26.1,31.62 26.8,32.32
N$5  (via drill 0.3)
  Top 0.254: 6.6,26.67 6.98,26.67 7.56,27.24 U1.2 | R19.1 6.6,25.21 6.6,26.67 | v5.59,26.67 6.6,26.67
  Bottom 0.254: J1.LCD-D2 2.52,27.5 4.13,27.5 4.95,26.67 v5.59,26.67
N$6  (via drill 0.3)
  Top 0.254: U$2.8 19.5,23.68 19.05,24.13 v18.22,24.13 | J2.15 18.01,6.45 16.89,5.33 11.49,5.33 10.61,6.22 10.1,6.73 9.65,7.18 v9.65,23.56
  Bottom 0.254: v18.22,24.13 10.22,24.13 v9.65,23.56
N$7  (via drill 0.3)
  Top 0.254: U$2.9 18.85,21.58 18.99,21.72 18.99,22.99 18.67,23.3 v16.95,23.3 | J2.16 17.53,8.64 17.53,6.6 16.7,5.78 11.81,5.78 11.34,6.26 10.67,6.92 10.29,7.3 10.29,22.61 v10.67,22.99
  Bottom 0.254: v16.95,23.3 10.99,23.3 v10.67,22.99
N$8  (via drill 0.3)
  Top 0.254: U$1.23 18.36,30.3 v18.03,29.97 | 18.92,16.13 18.41,16.64 15.56,16.64 15.05,16.13 14.86,16.13 14.1,16.89 14.1,26.48 17.59,29.97 v18.03,29.97 | v18.03,29.97 17.59,29.97 | U$1.29 21.36,30.33 v21.34,30.3
  Bottom 0.254: L1.1 C10.1 19.43,29.54 19.13,29.23 | 19.13,29.23 19.56,29.23 20.68,28.12 C12.1 | 21.43,28.6 C12.1 | 19.13,29.23 17.31,29.23 C9.1 17.59,29.97 v18.03,29.97 | v21.34,30.3 21.34,28.26 C12.1
N$9  (via drill 0.3)
  Top 0.254: v8.32,23.94 8.32,23.43 9.02,22.73 9.02,6.99 11.18,4.83 17.08,4.83 18.51,6.26 J2.14 | 20.15,24.62 v20.13,24.64 19.94,24.45 19.94,21.72 20.15,21.51 U$2.7
  Bottom 0.254: v8.32,23.94 9.08,24.7 17.53,24.7 17.78,24.95 19.81,24.95 v20.13,24.64
N$10  (via drill 0.3)
  Top 0.254: U$1.49 22.86,46.23 C13.1 C14.1 L2.1 C14.1 v20.38,45.28 | v10.35,40.13 10.69,40.47 U$1.3 12.15,40.47 | U$1.18 15.86,31.17 15.18,30.48 14.09,30.48 C16.1 13.46,30.67 13.46,29.27 13.08,28.89 v11.11,28.89
  Bottom 0.254: v20.38,45.28 20.38,43.24 20.07,42.93 9.78,42.93 9.27,42.42 9.27,40.26 C17.1 v10.35,40.13 10.99,39.5 10.99,38.61 11.11,38.48 v11.11,28.89
N$13
  Top 0.254: 21.59,27.43 23.37,25.65 23.37,22.86 24.13,22.1 24.13,21.34 24.64,20.83
TWI1_SCK  (via drill 0.3)
  Top 0.254: U$1.15 11.94,34.47 | 11.94,34.47 11.48,34.47 10.61,33.59 10.61,32.83 10.29,32.51 7.81,32.51 6.41,33.91 | 6.41,33.91 5.27,35.05 2.58,35.05 J1.TWI1-SCK | v19.37,27.94 19.62,27.69 20.57,27.69 22.86,25.4 22.86,22.35 23.4,21.81 U$2.2 | R3.2 6.23,43.81 v6.1,43.94 | v6.03,33.53 6.41,33.91 | v13.46,32.96 12.51,32.96 11.88,33.59 11.88,34.41 11.94,34.47
  Bottom 0.254: v6.1,43.94 6.1,33.59 v6.03,33.53 | v19.37,27.94 13.91,27.94 13.46,28.39 v13.46,32.96
TWI1_SDA  (via drill 0.3)
  Top 0.254: v18.29,26.92 18.54,27.18 20.32,27.18 22.1,25.4 22.1,22.1 22.75,21.45 U$2.3 | R4.2 5.08,40.45 4.89,40.26 2.59,40.26 J1.TWI1-SDA 2.71,37.47 4.25,37.47 4.83,36.89 4.83,36.51 5.02,36.32 5.97,36.32 7.75,34.54 10.86,34.54 11.28,34.97 U$1.14 14.24,34.97 14.61,34.61 14.86,34.61 15.11,34.35 v15.81,34.35
  Bottom 0.254: v18.29,26.92 13.27,26.92 12.57,27.62 12.57,33.97 12.95,34.35 v15.81,34.35
TX0+
  Top 0.254: J2.7 22.01,10.56 20.15,12.43 U$2.18 20.15,16.56 18.67,18.03 17.14,18.03 16.64,17.53 16,17.53 14.99,18.54 14.99,25.78 17.78,28.58 18.41,28.58 19.36,29.52 U$1.25
TX0-
  Top 0.254: J2.9 21.01,10.87 19.5,12.38 U$2.17 19.5,16.51 18.41,17.59 17.4,17.59 16.89,17.08 15.49,17.08 14.54,18.03 14.54,26.1 17.46,29.02 18.22,29.02 18.86,29.66 U$1.24
TX1+
  Top 0.254: J2.4 23.51,11.03 22.1,12.45 U$2.21 22.1,16.89 21.72,17.27 21.72,17.78 22.1,18.16 24.89,18.16 25.65,18.92 25.65,21.59 25.15,22.1 25.15,22.86 24.38,23.62 24.38,27.18 22.8,28.77 20.89,28.77 20.45,29.21 20.45,30.73 20.86,31.15 U$1.28
TX1-
  Top 0.254: 22.54,8.69 J2.6 22.51,11.34 21.45,12.4 U$2.20 21.45,16.65 20.83,17.27 20.83,18.41 21.08,18.67 24.64,18.67 25.15,19.18 25.15,21.34 24.64,21.84 24.64,22.61 23.88,23.37 23.88,25.91 21.46,28.32 20.45,28.32 20,28.77 20,30.92 20.36,31.29 U$1.27
TX2+
  Top 0.254: J2.1 25.01,11.38 23.4,12.99 U$2.23 23.4,15.52 24,16.13 27.3,16.13 28.19,17.02 28.19,19.69 27.81,20.07 27.43,20.07 27.18,20.32 27.18,22.35 26.67,22.86 26.67,23.62 25.91,24.38 25.91,28.19 23.37,30.73 23.11,30.73 22.36,31.48 U$1.31
TX2-
  Top 0.254: J2.3 24,11.68 22.75,12.94 U$2.22 22.75,15.63 23.69,16.57 26.86,16.57 27.24,16.95 27.24,17.59 26.92,17.91 26.92,18.54 27.05,18.67 27.43,18.67 27.56,18.8 27.56,19.18 27.3,19.43 27.05,19.43 26.67,19.81 26.67,22.1 26.16,22.61 26.16,23.37 25.4,24.13 25.4,27.94 23.11,30.23 22.92,30.23 21.86,31.29 U$1.30
TXC+
  Top 0.254: J2.10 20.51,10.54 18.85,12.21 U$2.16 18.85,15.57 18.22,16.19 15.75,16.19 15.24,15.69 14.61,15.69 13.65,16.64 13.65,26.73 17.86,30.95 U$1.22
TXC-
  Top 0.254: J2.12 19.51,10.78 18.2,12.09 U$2.15 18.2,15.39 17.84,15.75 16.13,15.75 15.49,15.11 14.1,15.11 13.21,16 13.21,26.99 17.34,31.12 17.34,32.19 U$1.21
VCC  (via drill 0.3, 0.6)
  Top 0.254: L5.2 C7.1 | C7.1 7.37,48.58 | C15.1 L2.2 | 24.38,12.83 24.45,12.76 26.61,12.76 26.54,12.83 | C1.1 26.54,12.83 | 13.16,37.97 U$1.8 15.18,37.97 v15.24,37.91 | U$2.24 24.05,13.16 24.38,12.83 | 24.38,12.83 26.54,12.83 | U$1.35 22.82,34.97 v22.61,35.18 | v15.11,35.43 15.08,35.47 U$1.13 14.51,35.47 | U$1.7 12.27,38.47 v11.81,38.93 11.86,38.97 U$1.6 | U$1.10 15.16,36.97 v15.24,36.89 | U$2.12 16.5,19.95 16.13,20.32 16.13,24.45 v17.08,25.46 | R2.2 8.45,25.27 v8,25.27 7.49,24.77 7.49,23.75 7.05,23.75 R19.2 6.86,23.12 | C15.1 | v8.13,43.62 R3.1 R4.1 8.12,39.69 7.3,38.86 7.11,38.86 6.54,38.29 R1.2 | 26.54,12.83 33.66,12.83 35.56,14.73 37.72,14.73 38.16,15.18 38.16,15.3 38.16,44.83 37.66,45.34 v35.43,45.34 | C7.1 6.26,48.58 v5.65,47.97 | C15.1 14.49,48.45 v14.36,48.32
  Top 0.406: 38.16,7.81 38.16,15.3
  Top 0.61: 6.86,23.12 8,21.98 8,5.14 9.02,4.13 32.13,4.13 35.18,7.18 37.53,7.18 38.16,7.81
  Top 1.016: v32.51,37.85 31.37,38.99 v31.37,42.8
  Bottom 0.254: L1.2 24.38,30.92 C11.1 25.65,30.8 28.38,30.8 28.89,30.29 28.89,29.53 27.81,28.45 26.86,28.45 24.07,25.65 19.24,25.65 19.05,25.46 v17.08,25.46 16.89,25.65 8.38,25.65 v8,25.27 | 22.61,35.88 v22.61,35.18 | J1.VCC3V3 1.25,44.49 2.54,45.85 | 2.54,47.18 3.24,47.82 5.14,47.82 | v5.65,47.97 5.14,47.82 | v14.36,48.32 13.78,47.82 | 13.78,47.82 5.14,47.82 | v8.13,43.62 8.19,43.69 19.11,43.69 19.62,44.2 19.62,45.21 18.54,46.29 | 18.54,46.29 14.35,46.29 14.16,46.48 14.16,47.43 13.78,47.82 | 18.54,46.29 25.27,46.29 26.86,44.7 34.8,44.7 v35.43,45.34
  Bottom 0.61: 2.54,45.85 2.54,47.18
  Bottom 1.016: v15.24,37.91 v15.24,36.89 15.24,35.56 v15.11,35.43 | 22.23,37.91 22.61,37.53 22.61,35.88 | 22.23,37.91 14.08,37.91 13.02,38.97 11.86,38.97 v11.81,38.93 | v31.37,42.8 31.37,44.39 30.99,44.77 | v32.51,37.85 32.45,37.91 22.23,37.91
  pour Bottom (isolate 0.254): 0.13,0 40.89,0 40.89,50 0.13,50
VCC_5V_DCC  (via drill 0.3, 0.6)
  Top 0.254: v37.34,22.41 28.26,22.41 27.56,23.11 27.56,23.75 26.61,24.7 26.61,26.99 v27.24,27.62 | U$2.11 17.55,21.06 v17.08,21.53
  Bottom 0.254: J1.VCC5V@1 38.1,47.83 38.1,23.05 37.47,22.41 v37.34,22.41 | v27.24,27.62 26.16,26.54 26.16,22.35 25.15,21.34 17.27,21.34 v17.08,21.53 16.45,21.53 16.26,21.34 C3.1
VOUT  (via drill 0.6)
  Top 0.254: POWER_USB.VBUS 31.91,44.54 31.69,44.32 26.86,44.32 26.54,44.64 26.54,46.55 v26.29,46.8
  Bottom 0.254: J1.CHG-IN 24.01,49.08 v26.29,46.8

### Text on the board
Unrouted: ordered 2016/07/12